# Altium project landslide_iot.PrjPcb
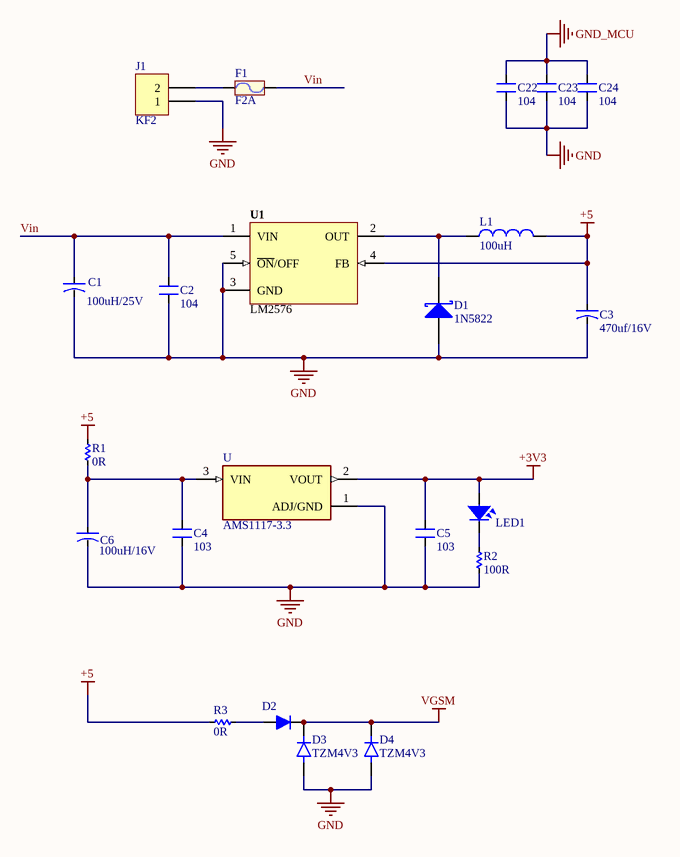
[diagram p0: power_scm.SchDoc]
3 sheets, 72 parts. Net scope: global (net labels, ports and power ports of the same name join across sheets).
Board file: landslide_pcb.PcbDoc
Sheets:
  power_scm.SchDoc
  MCU_scm.SchDoc
  Sheet2.SchDoc

## Sheet power_scm.SchDoc
size A; SheetNumber: 1; SheetTotal: 3

### Parts
C1  100uH/25V  [CAP-ALU-SMD-6.3x7.7x2.2]
C2  104  [SM-0805]
C3  470uf/16V  [CAP-ALU-SMD-6.3x7.7x2.2]
C4  103  [SM-0805]
C5  103  [SM-0805]
C6  100uH/16V  [CAP-ALU-SMD-6.3x7.7x2.2]
C22  104  [SM-0805]
C23  104  [SM-0805]
C24  104  [SM-0805]
D1  1N5822  [Diode_SS34]
D2  (no value)  [1N4007_SMD]
D3  TZM4V3  [DIO_LL4148]
D4  TZM4V3  [DIO_LL4148]
F1  F2A  [FUSE2]
J1  KF2  [KF2-5.08]
L1  value 100uH  [inductor_smd]  (hidden comment: Inductor)
LED1  LED  [LED-0805-Green]  (value not drawn)
R1  0R  [RES-SMD-0805]
R2  100R  [RES-SMD-0805]
R3  0R  [RES-SMD-0805]
U  AMS1117-3.3  [SOT229P700X180-4N]
U1  LM2576  [TO263]

### Nets
+3V3: C5.1 LED1.1 U.2(VOUT)
+5: C3.1 L1.2 R1.1 R3.1 U1.4(FB)
GND: C1.2 C2.2 C3.2 C4.2 C5.2 C6.2 C22.1 C23.1 C24.1 D1.1(A) D3.A D4.A J1.1 R2.2 U.1(ADJ/GND) U1.3(GND) U1.5(~{ON}/OFF)
GND_MCU: C22.2 C23.2 C24.2
VGSM: D2.2 D3.C D4.C
Vin: C1.1 C2.1 F1.2 U1.1(VIN)
NetC4_1: C4.1 C6.1 R1.2 U.3(VIN)
NetD1_2: D1.2(K) L1.1 U1.2(OUT)
NetD2_1: D2.1 R3.2
NetF1_1: F1.1 J1.2
NetLED1_2: LED1.2 R2.1

### Library data of the parts
C1 C3 C6 = CN-ALU-SMD: Polarized Capacitor (Axial); Published: 8-Jun-2000; LatestRevisionDate: 17-Jul-2002; LatestRevisionNote: Re-released for DXP Platform.; PackageReference: POLAR0.8; Publisher: Altium Limited
C2 C22-C24 = CM: Cap SMD; Value: 103
C4 C5 = CM: Cap SMD; Value: 103
D1 = 1N5819: Schottky diode
D2 = diode
D3 D4 = LL4148: Diode Standard 100V 200mA Surface Mount SOD-80; MF: ON Semiconductor; Package: SOD-80 Taitron; Availability: Unavailable; MP: LL4148; Value: *; SnapEDA_Link: https://www.snapeda.com/parts/LL4148/ON%20Semiconductor/view-part/2182678/?ref=snap; Price: None
F1 = Fuse: Designed by: VanDungEvn; Value: Fuse
J1 = KF2: Manufacturer: Würth Elektronik eiSos GmbH; partNo: 691103110002; ComponentLink1 Description: Manufacturer; ComponentLink2 Description: Datasheet; NoPins: 2; Created Date: 29 October 2013; ComponentLink1URL: http://www.we-online.com; ComponentLink2URL: http://katalog.we-online.de/em/datasheet/6911031100xx.pdf; Created by: Karrer Zheng
LED1 = LED SMD: Value: LED 3 - 5 ly 2 Colour
R1-R3 = Res-SMD: Resistor; Manufacturer: Generic Components; Class: Passive; Published: 08/06/2000; Publisher: Altium Hobart Technology Centre
U = AMS1117-3.3: Sot223/Pkg 1-Amp 3.3-Volt Low Drop Out Voltage Regulatator; MF: Advanced Monolithic Systems; Price: None; Package: None; Value: *; MP: AMS1117-3.3; Availability: Unavailable; SnapEDA_Link: https://www.snapeda.com/parts/AMS1117-3.3/Advanced%20Monolithic%20Systems/view-part/53450/?ref=snap
U1 = LM2576: Max Input Voltage: 12 V; Max Output Current: 3 (6.0 peak) A; Max Output Voltage: mV; Category: IC-Power; Min Input Voltage: mV; Min Output Voltage: mV; Mounting Technology: Surface Mount; Status: Unreleased; Supply Voltage: mV; Temperature Range: -40 to +125 degC
L1 = Inductor: Published: 8-Jun-2000; Revision: July-2002: Re-released for DXP Platform.; Publisher: Altium Limited

## Sheet MCU_scm.SchDoc
size A4; SheetNumber: 2; SheetTotal: 3
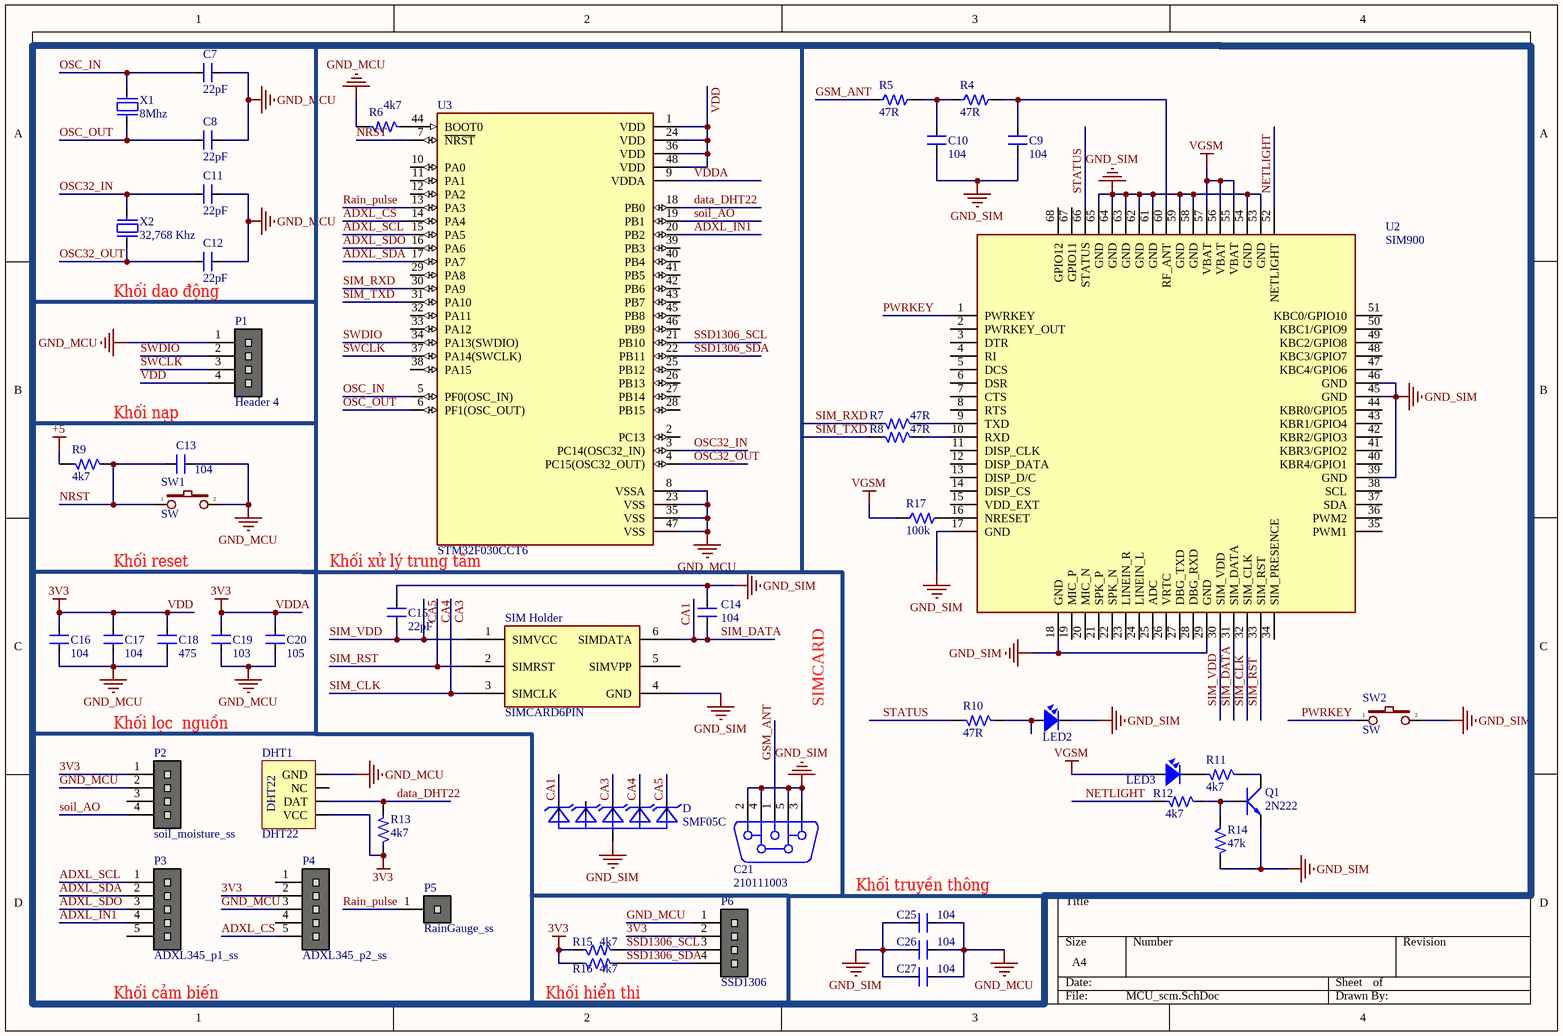
[diagram p1: MCU_scm.SchDoc]

### Parts
C7  22pF  [CN1.5]
C8  22pF  [CN1.5]
C9  104  [SM-0805]
C10  104  [SM-0805]
C11  22pF  [CN1.5]
C12  22pF  [CN1.5]
C13  104  [SM-0805]
C14  104  [SM-0805]
C15  22pF  [SM-0805]
C16  104  [SM-0805]
C17  104  [SM-0805]
C18  475  [SM-0805]
C19  103  [SM-0805]
C20  105  [SM-0805]
C21  210111003  [SMA-RA]
C25  104  [SM-0805]
C26  104  [SM-0805]
C27  104  [SM-0805]
D  SMF05C  [SC70-6]
DHT1  DHT22  [DHT22]
LED2  LED  [LED-0805-Green]  (value not drawn)
LED3  LED  [LED-0805-Green]  (value not drawn)
P1  Header 4  [HDR 1X4]
P2  soil_moisture_ss  [HDR 1X4]
P3  ADXL345_p1_ss  [HDR 1X5]
P4  ADXL345_p2_ss  [HDR 1X5]
P5  RainGauge_ss  [HDR 1X1]
P6  SSD1306  [HDR 1X4]
Q1  2N222  [TO92-123]
R4  47R  [R-0805]
R5  47R  [R-0805]
R6  4k7  [R-0805]
R7  47R  [R-0805]
R8  47R  [R-0805]
R9  4k7  [R-0805]
R10  47R  [R-0805]
R11  4k7  [R-0805]
R12  4k7  [R-0805]
R13  4k7  [R-0805]
R14  47k  [R-0805]
R15  4k7  [R-0805]
R16  4k7  [R-0805]
R17  100k  [R-0805]
SIM_Holder  SIMCARD6PIN  [SIMCARD6pin]
SW1  SW  [SW1-SMD]
SW2  SW  [SW1-SMD]
U2  SIM900  [SIM900]
U3  STM32F030CCT6  [QFP50P900X900X160-48N]
X1  8Mhz  [XT2]
X2  32,768 Khz  [XT32k]

### Nets
3V3: C16.2 C17.2 C18.2 C19.2 C20.2 DHT1.1(VCC) P1.4 P2.1 P4.2 P6.2 R13.1 R15.1 R16.1 U3.1(VDD) U3.9(VDDA) U3.24(VDD) U3.36(VDD) U3.48(VDD)  [also labelled VDD, VDDA]
+5: R9.2
GND_MCU: C7.1 C8.1 C11.1 C12.1 C13.2 C16.1 C17.1 C18.1 C19.1 C20.1 C25.2 C26.2 C27.2 DHT1.4(GND) P1.1 P2.2 P4.3 P6.1 R6.2 SW1.2 U3.8(VSSA) U3.23(VSS) U3.35(VSS) U3.47(VSS)
GND_SIM: C9.1 C10.1 C14.2 C15.2 C21.2 C21.3 C21.4 C21.5 C25.1 C26.1 C27.1 D.2(A) LED2.2 Q1.1(E) R14.2 SIM_Holder.4(GND) SW2.2 U2.17(GND) U2.18(GND) U2.29(GND) U2.39(GND) U2.45(GND) U2.46(GND) U2.53(GND) U2.54(GND) U2.58(GND) U2.59(GND) U2.61(GND) U2.62(GND) U2.63(GND) U2.64(GND) U2.65(GND)
VGSM: LED3.1 R17.1 U2.55(VBAT) U2.56(VBAT) U2.57(VBAT)
ADXL_CS: P4.5 U3.14(PA4)
ADXL_IN1: P3.4 U3.20(PB2)
ADXL_SCL: P3.1 U3.15(PA5)
ADXL_SDA: P3.2 U3.17(PA7)
ADXL_SDO: P3.3 U3.16(PA6)
CA1: C14.1 D.1(C1) SIM_Holder.6(SIMDATA) U2.31(SIM_DATA)  [also labelled SIM_DATA]
CA3: D.4(C3) SIM_Holder.3(SIMCLK) U2.32(SIM_CLK)  [also labelled SIM_CLK]
CA4: D.5(C4) SIM_Holder.2(SIMRST) U2.33(SIM_RST)  [also labelled SIM_RST]
CA5: C15.1 D.6(C5) SIM_Holder.1(SIMVCC) U2.30(SIM_VDD)  [also labelled SIM_VDD]
data_DHT22: DHT1.2(DAT) R13.2 U3.18(PB0)
GSM_ANT: C21.1 R5.1
NETLIGHT: R12.2 U2.52(NETLIGHT)
NRST: C13.1 R9.1 SW1.1 U3.7(~{NRST})
OSC32_IN: C11.2 U3.3(PC14(OSC32_IN)) X2.2
OSC32_OUT: C12.2 U3.4(PC15(OSC32_OUT)) X2.1
OSC_IN: C7.2 U3.5(PF0(OSC_IN)) X1.2
OSC_OUT: C8.2 U3.6(PF1(OSC_OUT)) X1.1
PWRKEY: SW2.1 U2.1(PWRKEY)
Rain_pulse: P5.1 U3.13(PA3)
SIM_RXD: R7.2 U3.30(PA9)
SIM_TXD: R8.2 U3.31(PA10)
soil_AO: P2.4 U3.19(PB1)
SSD1306_SCL: P6.3 R15.2 U3.21(PB10)
SSD1306_SDA: P6.4 R16.2 U3.22(PB11)
STATUS: R10.2 U2.66(STATUS)
SWCLK: P1.3 U3.37(PA14(SWCLK))
SWDIO: P1.2 U3.34(PA13(SWDIO))
NetC9_2: C9.2 R4.2 U2.60(RF_ANT)
NetC10_2: C10.2 R4.1 R5.2
NetLED2_1: LED2.1 R10.1
NetLED3_2: LED3.2 R11.2
NetQ1_2: Q1.2(B) R12.1 R14.1
NetQ1_3: Q1.3(C) R11.1
NetR6_1: R6.1 U3.44(BOOT0)
NetR7_1: R7.1 U2.9(TXD)
NetR8_1: R8.1 U2.10(RXD)
NetR17_2: R17.2 U2.16(NRESET)

Not connected (* = marked no-connect by the designer): D 3(C2); DHT1 3(NC); P2 3; P3 5; P4 1 4; SIM_Holder 5(SIMVPP); U2 2(PWRKEY_OUT) 3(DTR) 4(RI) 5(DCS) 6(DSR) 7(CTS) 8(RTS) 11(DISP_CLK) 12(DISP_DATA) 13(DISP_D/C) 14(DISP_CS) 15(VDD_EXT) 19(MIC_P) 20(MIC_N) 21(SPK_P) 22(SPK_N) 23(LINEIN_R) 24(LINEIN_L) 25(ADC) 26(VRTC) 27(DBG_TXD) 28(DBG_RXD) 34(SIM_PRESENCE) 35(PWM1) 36(PWM2) 37(SDA) 38(SCL) 40(KBR4/GPIO1) 41(KBR3/GPIO2) 42(KBR2/GPIO3) 43(KBR1/GPIO4) 44(KBR0/GPIO5) 47(KBC4/GPIO6) 48(KBC3/GPIO7) 49(KBC2/GPIO8) 50(KBC1/GPIO9) 51(KBC0/GPIO10) 67(GPIO11) 68(GPIO12); U3 2(PC13) 10(PA0) 11(PA1) 12(PA2) 25(PB12) 26(PB13) 27(PB14) 28(PB15) 29(PA8) 32(PA11) 33(PA12) 38(PA15) 39(PB3) 40(PB4) 41(PB5) 42(PB6) 43(PB7) 45(PB8) 46(PB9)

### Notes on the sheet
- (near C12) Khối dao động
- Khối nạp
- Khối reset
- Khối xử lý trung tâm
- SIMCARD
- (near P2) Khối lọc  nguồn
- (near C25) Khối truyền thông
- (near P3) Khối cảm biến
- Khối hiển thị

### Library data of the parts
C7 C8 C11 C12 = CN1.5: Cap np 682pF => 104pF; Value: 0.01uF
C9 C10 C13-C18 C20 C25-C27 = CM: Cap SMD; Value: 103
C19 = CM: Cap SMD; Value: 103
C21 = CON Ant: CONNECTOR ANTEN; Manufacturer: Würth Elektronik eiSos GmbH; partNo: 210111003; ComponentLink1Description: Manufacturer; ComponentLink1URL: http://www.we-online.de; Created by: Christin Zierenner; Created Date: May 2012; ComponentLink2Description: Datasheet; ComponentLink2URL: http://katalog.we-online.de/kataloge/eisos/index.php?language=en&pf=Filter_gerade
D = SMF05C: 12.5V Clamp 8A _8/20Âµs_ Ipp Tvs Diode Surface Mount SC-88/SC70-6/SOT-363; MF: ON Semiconductor; Availability: Unavailable; Price: None; Package: SOT-363 ON Semiconductor; Value: *; SnapEDA_Link: https://www.snapeda.com/parts/SMF05C/ON%20Semiconductor/view-part/2782704/?ref=snap; MP: SMF05C
DHT1 = DHT22: Manufacturer: W¨¹rth Elektronik eiSos GmbH; partNo: 613004143121; ComponentLink1 Description: Manufacturer; ComponentLink2 Description: Datasheet; NoPins: 04; Created Date: 29 March 2013; ComponentLink1URL: http://www.we-online.com; ComponentLink2URL: http://katalog.we-online.de/em/datasheet/6130xx143121.pdf; Created by: Karrer Zheng
LED2 LED3 = LED SMD: Value: LED 3 - 5 ly 2 Colour
P1 P2 P6 = Header 4: Header, 4-Pin
P3 P4 = Header 5: Header, 5-Pin
P5 = Header 1: Header, 1-Pin
Q1 = 2N222: NPN 600mW, ECB; Value: C1815; Creat by: MT-TECH.VN
R4-R17 = resistor: dien tro; value: 1k
SW1 SW2 = SW2: Switch button 2 pin; Value: SW chip 2 pin
U3 = STM32F030CCT6: ARMÂ® CortexÂ®-M0 STM32F0 Microcontroller IC 32-Bit 48MHz 256KB _256K x 8_ FLASH 48-LQFP _7x7_; MF: STMicroelectronics; Value: *; Digi-Key_Purchase_URL: https://www.digikey.com.ar/product-detail/en/stmicroelectronics/STM32F030CCT6TR/497-17332-2-ND/6833532?utm_source=snapeda&utm_medium=aggregator&utm_campaign=symbol; MP: STM32F030CCT6; Package: LQFP-48 STMicroelectronics; SnapEDA_Link: https://www.snapeda.com/parts/STM32F030CCT6/STMicroelectronics/view-part/447161/?ref=snap; Digi-Key_Part_Number: 497-17332-2-ND
X1 = XT2: Crystal For all Crystal 2pin.; Value: 4Mhz
X2 = XT32k: Crystal 32,768kHz for timer real; Value: 32,768khz

## Sheet Sheet2.SchDoc
size A; SheetNumber: 3; SheetTotal: 3

## Nets that join several sheets
+5: power_scm (5 pins), MCU_scm (R9.2)
GND_MCU: power_scm (C22.2 C23.2 C24.2), MCU_scm (24 pins)
VGSM: power_scm (D2.2 D3.C D4.C), MCU_scm (5 pins)